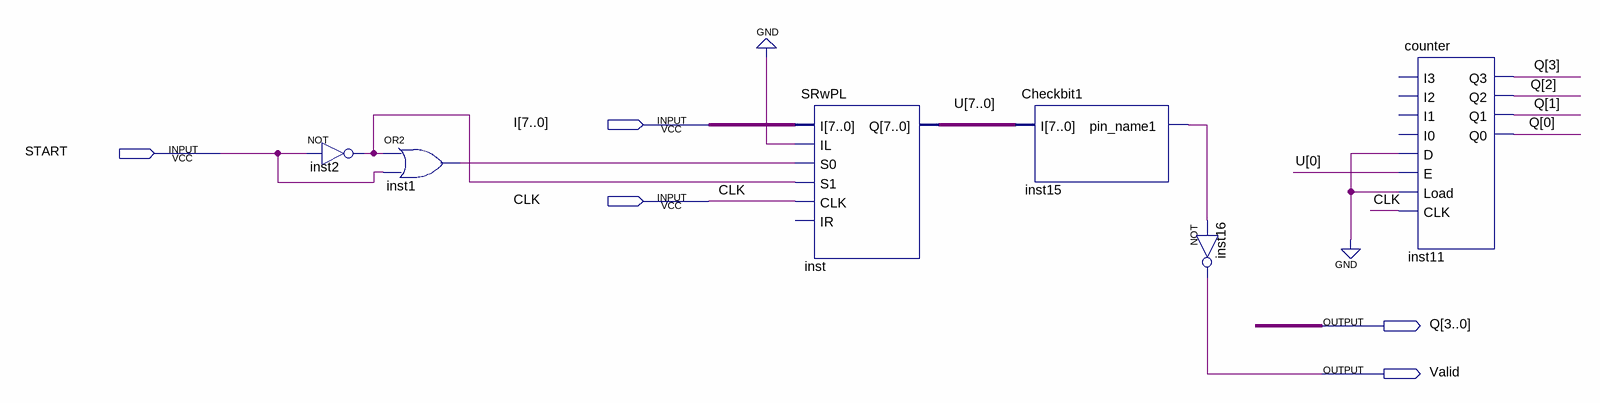
[diagram p0: schematic sheet]
// Quartus schematic counterbit1.bdf as structural Verilog: 6 symbols, 5 pins
module counterbit1 (
  input  [7:0] I,
  input  START,
  input  CLK,
  output [3:0] Q,
  output Valid
);

  wire inst1_out, inst2_out, inst15_pin_name1;
  wire [7:0] U;

  not inst2 (inst2_out, START);
  or inst1 (inst1_out, inst2_out, START);
  SRwPL inst (.I(I), .IL(1'b0), .S0(inst1_out), .S1(inst2_out), .CLK(CLK), .Q(U));  // open: IR
  Checkbit1 inst15 (.I(U), .pin_name1(inst15_pin_name1));
  not inst16 (Valid, inst15_pin_name1);
  counter inst11 (
    .D(1'b0), .E(U[0]), .Load(1'b0), .CLK(CLK), .Q3(Q[3]), .Q2(Q[2]), .Q1(Q[1]), .Q0(Q[0]));  // open: I3, I2, I1, I0
endmodule
